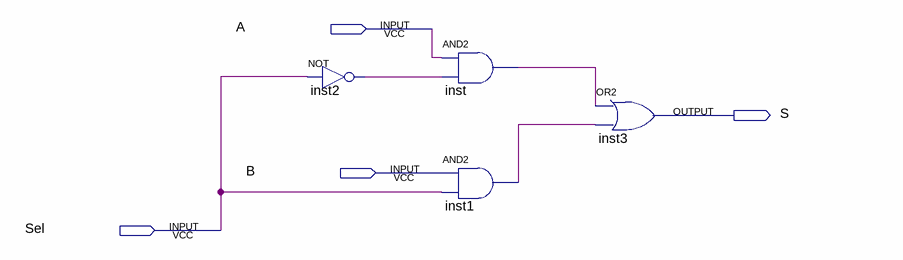
[diagram p0: schematic sheet]
// Quartus schematic mux2-1.bdf as structural Verilog: 4 symbols, 4 pins
module \mux2-1  (
  input  A,
  input  B,
  input  Sel,
  output S
);

  wire inst1_out, inst2_out, inst_out;

  not inst2 (inst2_out, Sel);
  and inst (inst_out, A, inst2_out);
  and inst1 (inst1_out, B, Sel);
  or inst3 (S, inst_out, inst1_out);
endmodule
